# EAGLE schematic adc8_v2 (EAGLE 5.12)

## Sheet 1 of 3
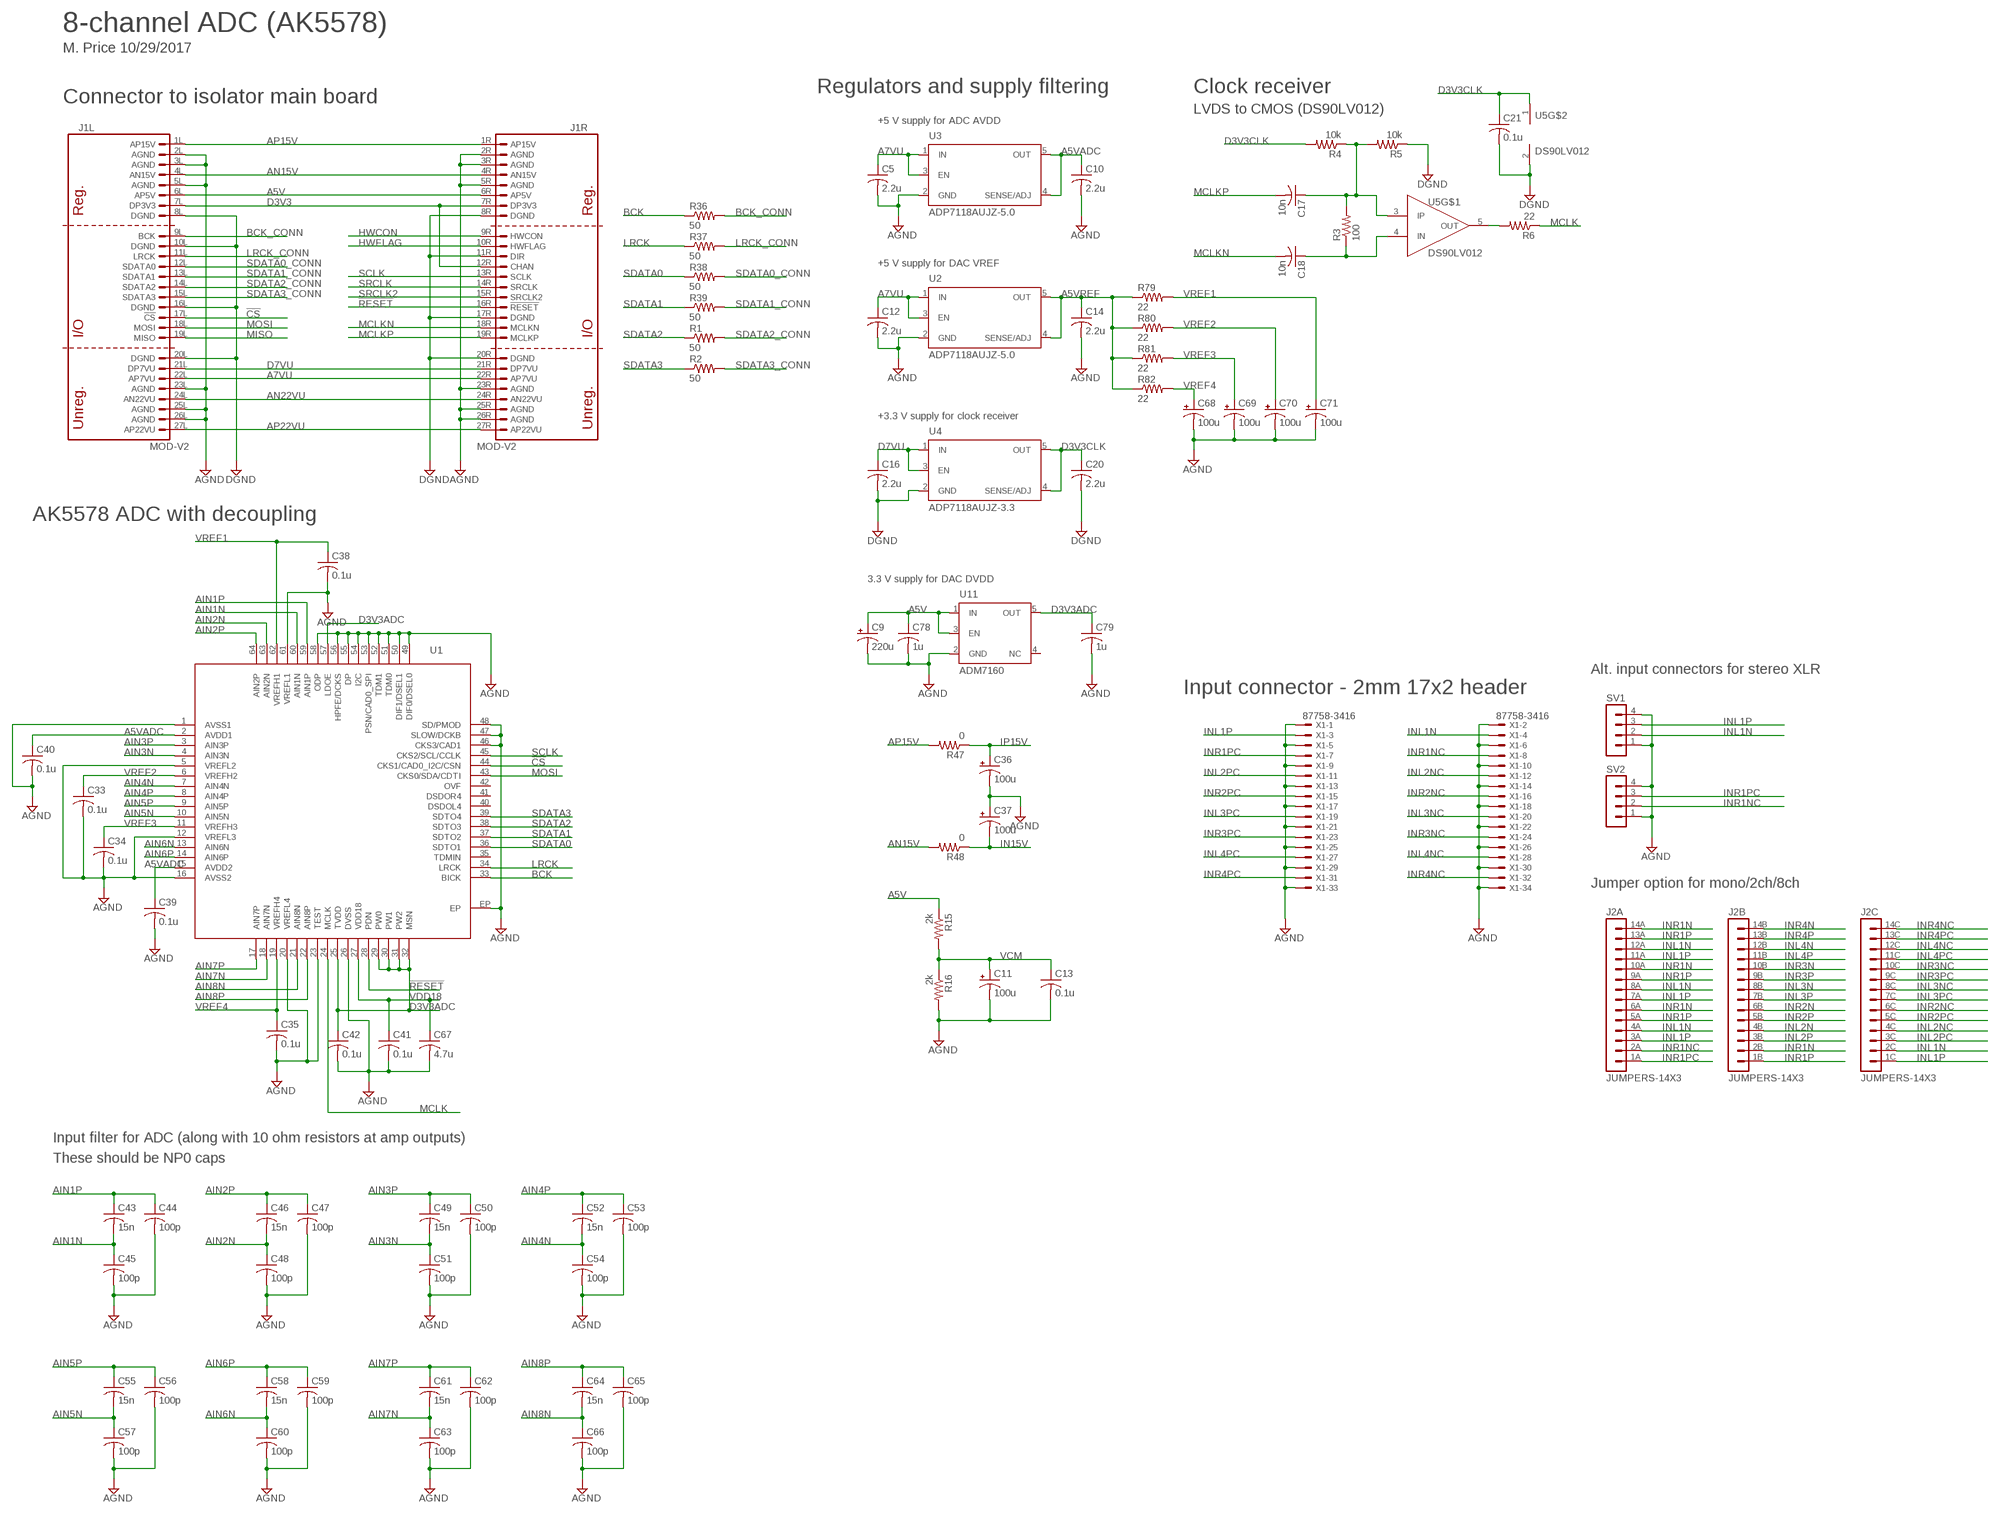
[diagram p0: schematic, sheet 1]

### Parts
C5  2.2u  C-USC0805  [C0805]
C9  220u  CPOL-USE  [PANASONIC_E]
C10  2.2u  C-USC0805  [C0805]
C11  100u  CPOL-USE  [PANASONIC_E]
C12  2.2u  C-USC0805  [C0805]
C13  0.1u  C-USC0603  [C0603]
C14  2.2u  C-USC0805  [C0805]
C16  2.2u  C-USC0805  [C0805]
C17  10n  C-USC0603  [C0603]
C18  10n  C-USC0603  [C0603]
C20  2.2u  C-USC0805  [C0805]
C21  0.1u  C-USC0603  [C0603]
C33  0.1u  C-USC0603  [C0603]
C34  0.1u  C-USC0603  [C0603]
C35  0.1u  C-USC0603  [C0603]
C36  100u  CPOL-USE  [PANASONIC_E]
C37  100u  CPOL-USE  [PANASONIC_E]
C38  0.1u  C-USC0603  [C0603]
C39  0.1u  C-USC0603  [C0603]
C40  0.1u  C-USC0603  [C0603]
C41  0.1u  C-USC0603  [C0603]
C42  0.1u  C-USC0603  [C0603]
C43  15n  C-USC0603  [C0603]
C44  100p  C-USC0603  [C0603]
C45  100p  C-USC0603  [C0603]
C46  15n  C-USC0603  [C0603]
C47  100p  C-USC0603  [C0603]
C48  100p  C-USC0603  [C0603]
C49  15n  C-USC0603  [C0603]
C50  100p  C-USC0603  [C0603]
C51  100p  C-USC0603  [C0603]
C52  15n  C-USC0603  [C0603]
C53  100p  C-USC0603  [C0603]
C54  100p  C-USC0603  [C0603]
C55  15n  C-USC0603  [C0603]
C56  100p  C-USC0603  [C0603]
C57  100p  C-USC0603  [C0603]
C58  15n  C-USC0603  [C0603]
C59  100p  C-USC0603  [C0603]
C60  100p  C-USC0603  [C0603]
C61  15n  C-USC0603  [C0603]
C62  100p  C-USC0603  [C0603]
C63  100p  C-USC0603  [C0603]
C64  15n  C-USC0603  [C0603]
C65  100p  C-USC0603  [C0603]
C66  100p  C-USC0603  [C0603]
C67  4.7u  C-USC1206  [C1206]
C68  100u  CPOL-USD  [PANASONIC_D]
C69  100u  CPOL-USD  [PANASONIC_D]
C70  100u  CPOL-USD  [PANASONIC_D]
C71  100u  CPOL-USD  [PANASONIC_D]
C78  1u  C-USC0603  [C0603]
C79  1u  C-USC0603  [C0603]
J1  MOD-V2  [MOD-V2]
J2  JUMPERS-14X3  [MA14-3]
R1  50  R-US_R0603  [R0603]
R2  50  R-US_R0603  [R0603]
R3  100  R-US_R0603  [R0603]
R4  10k  R-US_R0603  [R0603]
R5  10k  R-US_R0603  [R0603]
R6  22  R-US_R0603  [R0603]
R15  2k  R-US_R0603  [R0603]
R16  2k  R-US_R0603  [R0603]
R36  50  R-US_R0603  [R0603]
R37  50  R-US_R0603  [R0603]
R38  50  R-US_R0603  [R0603]
R39  50  R-US_R0603  [R0603]
R47  0  R-US_R0603  [R0603]
R48  0  R-US_R0603  [R0603]
R79  22  R-US_R0603  [R0603]
R80  22  R-US_R0603  [R0603]
R81  22  R-US_R0603  [R0603]
R82  22  R-US_R0603  [R0603]
SV1  MA04-1  [MA04-1]
SV2  MA04-1  [MA04-1]
U1  AK5558  [QFN64_EP_AKM]
U2  ADP7118AUJZ-5.0  ADP7118AUJZ  [SOT23-DBV]
U3  ADP7118AUJZ-5.0  ADP7118AUJZ  [SOT23-DBV]
U4  ADP7118AUJZ-3.3  ADP7118AUJZ  [SOT23-DBV]
U5  DS90LV012  [SOT23-DBV]
U11  ADM7160  [SOT23-DBV]
X1  87758-3416  [87758-3416]

### Nets
!CS: J1.17L(L:!CS) U1.44(CKS1/CAD0_I2C/CSN)
!RESET: J1.16R(R:!RESET) U1.28(PDN)
A5V: C9.+ C78.1 J1.6L(L:AP5V) J1.6R(R:AP5V) R15.1 U11.1(IN) U11.3(EN) ; also sheet 2,3
A5VADC: C10.1 C39.1 C40.1 U1.2(AVDD1) U1.15(AVDD2) U3.4(SENSE/ADJ) U3.5(OUT)
A5VREF: C14.1 R79.1 R80.1 R81.1 R82.1 U2.4(SENSE/ADJ) U2.5(OUT)
A7VU: C5.1 C12.1 J1.22L(L:AP7VU) J1.22R(R:AP7VU) U2.1(IN) U2.3(EN) U3.1(IN) U3.3(EN)
AGND: C5.2 C9.- C10.2 C11.- C12.2 C13.2 C14.2 C33.2 C34.2 C35.2 C36.- C37.+ C38.2 C39.2 C40.2 C41.2 C42.2 C44.2 C45.2 C47.2 C48.2 C50.2 C51.2 C53.2 C54.2 C56.2 C57.2 C59.2 C60.2 C62.2 C63.2 C65.2 C66.2 C67.2 C68.- C69.- C70.- C71.- C78.2 C79.2 J1.2L(L:AGND) J1.2R(R:AGND) J1.3L(L:AGND) J1.3R(R:AGND) J1.5L(L:AGND) J1.5R(R:AGND) J1.23L(L:AGND) J1.23R(R:AGND) J1.25L(L:AGND) J1.25R(R:AGND) J1.26L(L:AGND) J1.26R(R:AGND) R16.2 SV1.1 SV1.4 SV2.1 SV2.4 U1.1(AVSS1) U1.5(VREFL2) U1.12(VREFL3) U1.16(AVSS2) U1.20(VREFL4) U1.23(TEST) U1.26(DVSS) U1.46(CKS3/CAD1) U1.47(SLOW/DCKB) U1.48(SD/PMOD) U1.49(DIF0/DSEL0) U1.50(DIF1/DSEL1) U1.51(TDM0) U1.52(TDM1) U1.53(PSN/CAD0_SPI) U1.54(I2C) U1.55(DP) U1.56(HPFE/DCKS) U1.58(ODP) U1.61(VREFL1) U1.EP U2.2(GND) U3.2(GND) U11.2(GND) X1.1 X1.2 X1.5 X1.6 X1.9 X1.10 X1.13 X1.14 X1.17 X1.18 X1.21 X1.22 X1.25 X1.26 X1.29 X1.30 X1.33 X1.34 ; also sheet 2,3
AIN1N: C43.2 C45.1 U1.60(AIN1N) ; also sheet 2
AIN1P: C43.1 C44.1 U1.59(AIN1P) ; also sheet 2
AIN2N: C46.2 C48.1 U1.63(AIN2N) ; also sheet 2
AIN2P: C46.1 C47.1 U1.64(AIN2P) ; also sheet 2
AIN3N: C49.2 C51.1 U1.4(AIN3N) ; also sheet 2
AIN3P: C49.1 C50.1 U1.3(AIN3P) ; also sheet 2
AIN4N: C52.2 C54.1 U1.7(AIN4N) ; also sheet 2
AIN4P: C52.1 C53.1 U1.8(AIN4P) ; also sheet 2
AIN5N: C55.2 C57.1 U1.10(AIN5N) ; also sheet 3
AIN5P: C55.1 C56.1 U1.9(AIN5P) ; also sheet 3
AIN6N: C58.2 C60.1 U1.13(AIN6N) ; also sheet 3
AIN6P: C58.1 C59.1 U1.14(AIN6P) ; also sheet 3
AIN7N: C61.2 C63.1 U1.18(AIN7N) ; also sheet 3
AIN7P: C61.1 C62.1 U1.17(AIN7P) ; also sheet 3
AIN8N: C64.2 C66.1 U1.21(AIN8N) ; also sheet 3
AIN8P: C64.1 C65.1 U1.22(AIN8P) ; also sheet 3
AN15V: J1.4L(L:AN15V) J1.4R(R:AN15V) R48.2
AN22VU: J1.24L(L:AN22VU) J1.24R(R:AN22VU)
AP15V: J1.1L(L:AP15V) J1.1R(R:AP15V) R47.2
AP22VU: J1.27L(L:AP22VU) J1.27R(R:AP22VU)
BCK: R36.1 U1.33(BICK)
BCK_CONN: J1.9L(L:BCK) R36.2
D3V3: J1.7L(L:DP3V3) J1.7R(R:DP3V3) J1.12R(R:CHAN)
D3V3ADC: C42.1 C79.1 U1.25(TVDD) U1.29(PW0) U1.30(PW1) U1.31(PW2) U1.32(MSN) U1.57(LDOE) U11.5(OUT)
D3V3CLK: C20.1 C21.1 R4.2 U4.4(SENSE/ADJ) U4.5(OUT) U5.1(V+)
D7VU: C16.1 J1.21L(L:DP7VU) J1.21R(R:DP7VU) U4.1(IN) U4.3(EN)
DGND: C16.2 C20.2 C21.2 J1.8L(L:DGND) J1.8R(R:DGND) J1.10L(L:DGND) J1.11R(R:DIR) J1.16L(L:DGND) J1.17R(R:DGND) J1.20L(L:DGND) J1.20R(R:DGND) R5.1 U4.2(GND) U5.2(V-)
HWCON: J1.9R(R:HWCON)
HWFLAG: J1.10R(R:HWFLAG)
IN15V: C37.- R48.1 ; also sheet 2,3
INL1N: J2.2C J2.4A J2.8A J2.12A SV1.2 X1.4 ; also sheet 2
INL1P: J2.1C J2.3A J2.7A J2.11A SV1.3 X1.3 ; also sheet 2
INL2N: J2.4B ; also sheet 2
INL2NC: J2.4C X1.12
INL2P: J2.3B ; also sheet 2
INL2PC: J2.3C X1.11
INL3N: J2.8B ; also sheet 3
INL3NC: J2.8C X1.20
INL3P: J2.7B ; also sheet 3
INL3PC: J2.7C X1.19
INL4N: J2.12B ; also sheet 3
INL4NC: J2.12C X1.28
INL4P: J2.11B ; also sheet 3
INL4PC: J2.11C X1.27
INR1N: J2.2B J2.6A J2.10A J2.14A ; also sheet 2
INR1NC: J2.2A SV2.2 X1.8
INR1P: J2.1B J2.5A J2.9A J2.13A ; also sheet 2
INR1PC: J2.1A SV2.3 X1.7
INR2N: J2.6B ; also sheet 2
INR2NC: J2.6C X1.16
INR2P: J2.5B ; also sheet 2
INR2PC: J2.5C X1.15
INR3N: J2.10B ; also sheet 3
INR3NC: J2.10C X1.24
INR3P: J2.9B ; also sheet 3
INR3PC: J2.9C X1.23
INR4N: J2.14B ; also sheet 3
INR4NC: J2.14C X1.32
INR4P: J2.13B ; also sheet 3
INR4PC: J2.13C X1.31
IP15V: C36.+ R47.1 ; also sheet 2,3
LRCK: R37.1 U1.34(LRCK)
LRCK_CONN: J1.11L(L:LRCK) R37.2
MCLK: R6.1 U1.24(MCLK)
MCLKN: C18.2 J1.18R(R:MCLKN)
MCLKP: C17.2 J1.19R(R:MCLKP)
MISO: J1.19L(L:MISO)
MOSI: J1.18L(L:MOSI) U1.43(CKS0/SDA/CDTI)
N$16: C17.1 R3.2 R4.1 R5.2 U5.3(IP)
N$20: C18.1 R3.1 U5.4(IN)
N$24: R6.2 U5.5(OUT)
SCLK: J1.13R(R:SCLK) U1.45(CKS2/SCL/CCLK)
SDATA0: R38.1 U1.36(SDTO1)
SDATA0_CONN: J1.12L(L:SDATA0) R38.2
SDATA1: R39.1 U1.37(SDTO2)
SDATA1_CONN: J1.13L(L:SDATA1) R39.2
SDATA2: R1.1 U1.38(SDTO3)
SDATA2_CONN: J1.14L(L:SDATA2) R1.2
SDATA3: R2.1 U1.39(SDTO4)
SDATA3_CONN: J1.15L(L:SDATA3) R2.2
SRCLK: J1.14R(R:SRCLK)
SRCLK2: J1.15R(R:SRCLK2)
VCM: C11.+ C13.1 R15.2 R16.1 ; also sheet 2,3
VDD18: C41.1 C67.1 U1.27(VDD18)
VREF1: C38.1 C71.+ R79.2 U1.62(VREFH1)
VREF2: C33.1 C70.+ R80.2 U1.6(VREFH2)
VREF3: C34.1 C69.+ R81.2 U1.11(VREFH3)
VREF4: C35.1 C68.+ R82.2 U1.19(VREFH4)
Unconnected: U1.35(TDMIN) U1.40(DSDOL4) U1.41(DSDOR4) U1.42(OVF) U11.4(NC)

### Notes on the sheet
- 8-channel ADC (AK5578)
- M. Price 10/29/2017
- Regulators and supply filtering | Clock receiver
- Connector to isolator main board
- LVDS to CMOS (DS90LV012)
- +5 V supply for ADC AVDD
- +5 V supply for DAC VREF
- +3.3 V supply for clock receiver
- AK5578 ADC with decoupling
- 3.3 V supply for DAC DVDD
- Alt. input connectors for stereo XLR
- Input connector - 2mm 17x2 header
- Jumper option for mono/2ch/8ch
- Input filter for ADC (along with 10 ohm resistors at amp outputs)
- These should be NP0 caps

## Sheet 2 of 3
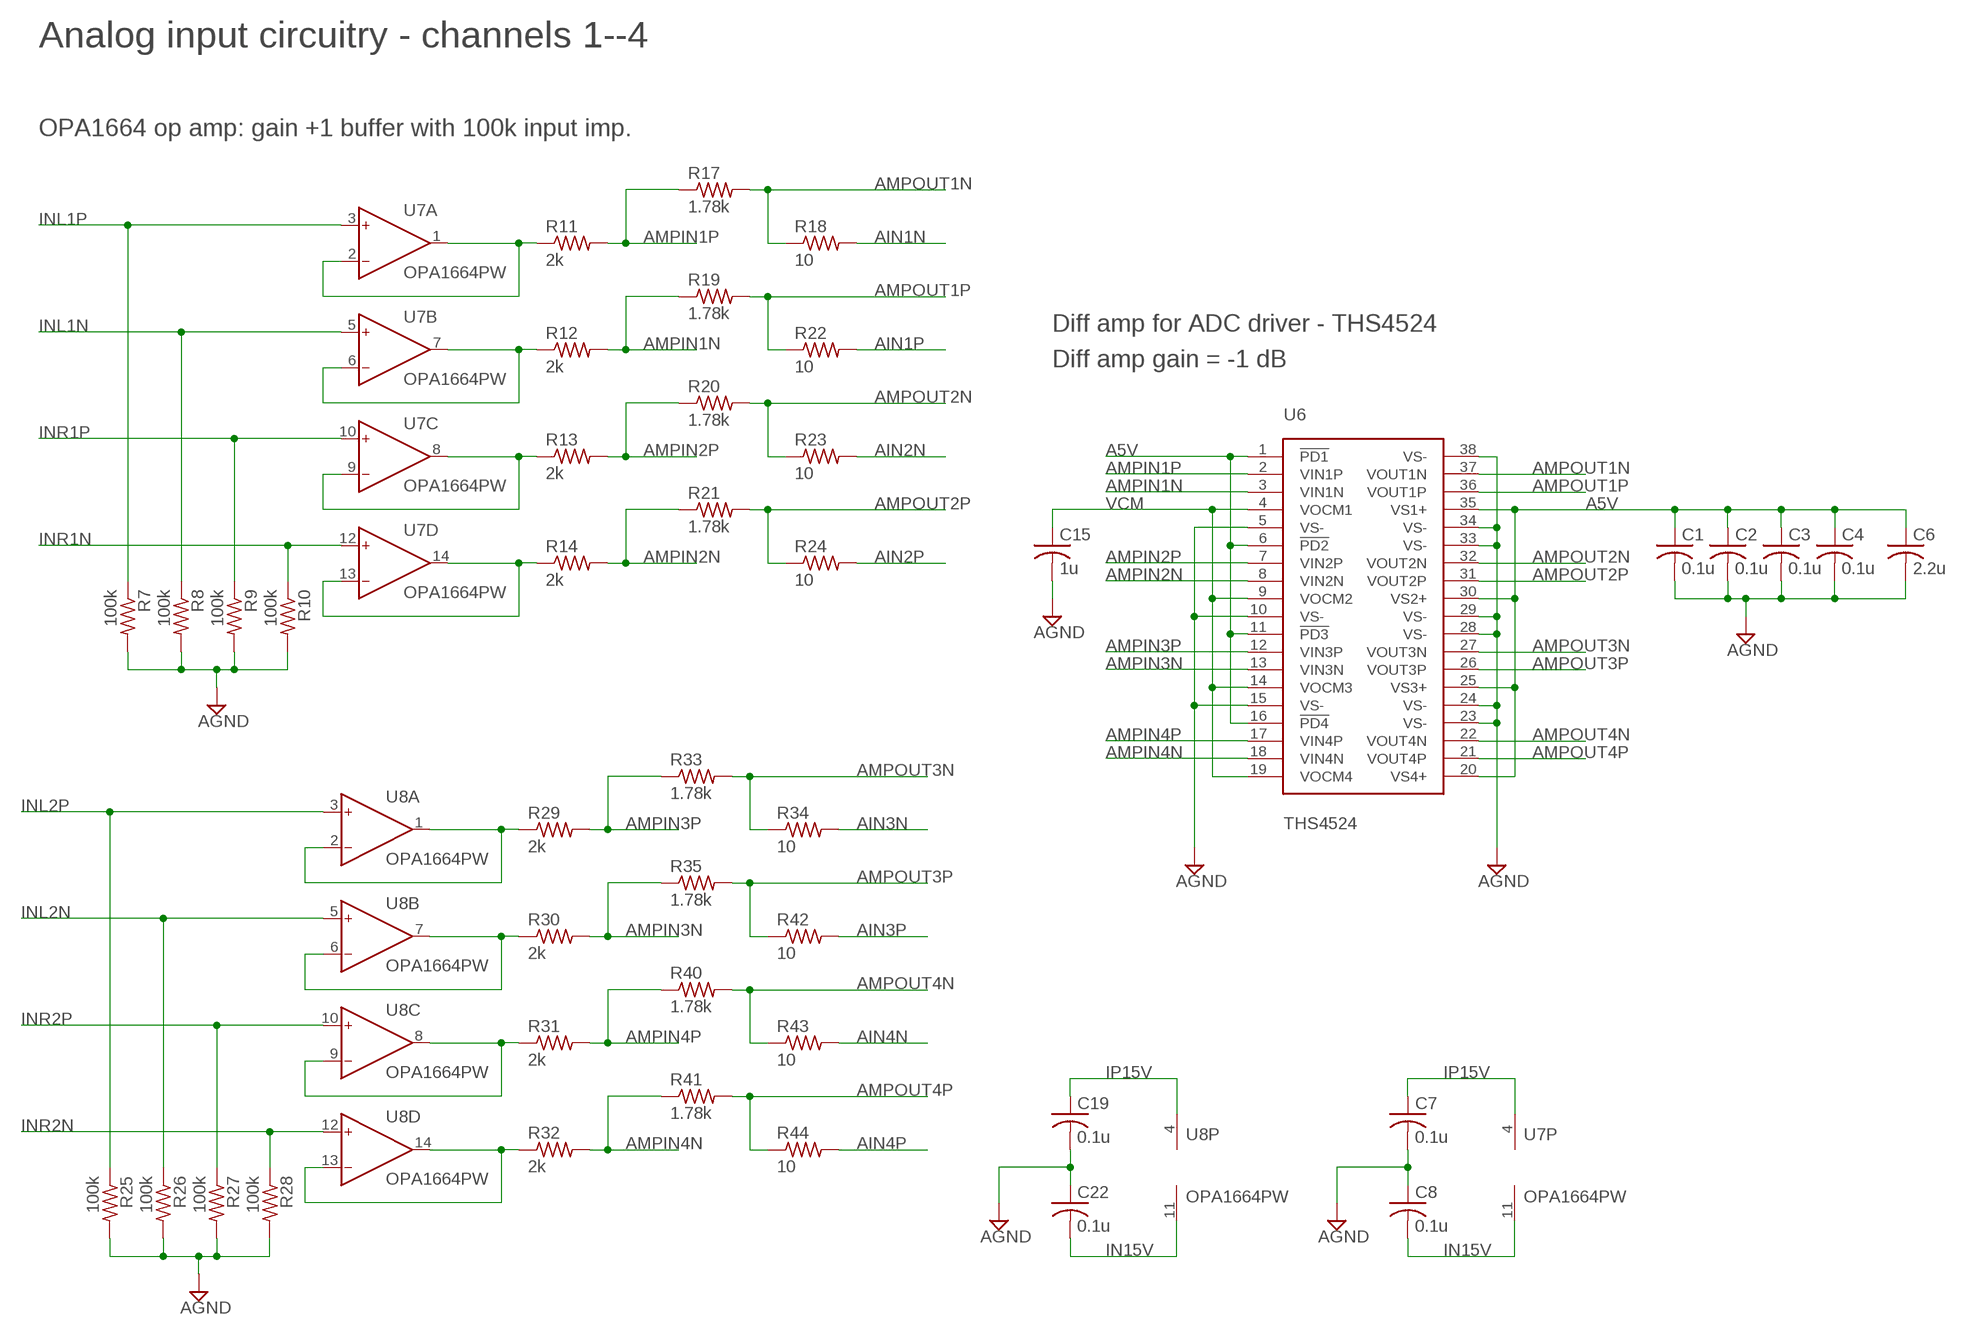
[diagram p1: schematic, sheet 2]

### Parts
C1  0.1u  C-USC0603  [C0603]
C2  0.1u  C-USC0603  [C0603]
C3  0.1u  C-USC0603  [C0603]
C4  0.1u  C-USC0603  [C0603]
C6  2.2u  C-USC0805  [C0805]
C7  0.1u  C-USC0603  [C0603]
C8  0.1u  C-USC0603  [C0603]
C15  1u  C-USC0603  [C0603]
C19  0.1u  C-USC0603  [C0603]
C22  0.1u  C-USC0603  [C0603]
R7  100k  R-US_R0603  [R0603]
R8  100k  R-US_R0603  [R0603]
R9  100k  R-US_R0603  [R0603]
R10  100k  R-US_R0603  [R0603]
R11  2k  R-US_R0603  [R0603]
R12  2k  R-US_R0603  [R0603]
R13  2k  R-US_R0603  [R0603]
R14  2k  R-US_R0603  [R0603]
R17  1.78k  R-US_R0603  [R0603]
R18  10  R-US_R0603  [R0603]
R19  1.78k  R-US_R0603  [R0603]
R20  1.78k  R-US_R0603  [R0603]
R21  1.78k  R-US_R0603  [R0603]
R22  10  R-US_R0603  [R0603]
R23  10  R-US_R0603  [R0603]
R24  10  R-US_R0603  [R0603]
R25  100k  R-US_R0603  [R0603]
R26  100k  R-US_R0603  [R0603]
R27  100k  R-US_R0603  [R0603]
R28  100k  R-US_R0603  [R0603]
R29  2k  R-US_R0603  [R0603]
R30  2k  R-US_R0603  [R0603]
R31  2k  R-US_R0603  [R0603]
R32  2k  R-US_R0603  [R0603]
R33  1.78k  R-US_R0603  [R0603]
R34  10  R-US_R0603  [R0603]
R35  1.78k  R-US_R0603  [R0603]
R40  1.78k  R-US_R0603  [R0603]
R41  1.78k  R-US_R0603  [R0603]
R42  10  R-US_R0603  [R0603]
R43  10  R-US_R0603  [R0603]
R44  10  R-US_R0603  [R0603]
U6  THS4524  [TSSOP38_R-PDSO-G38-DA]
U7  OPA1664PW  AD8544RU  [TSSOP14]
U8  OPA1664PW  AD8544RU  [TSSOP14]

### Nets
A5V: C1.1 C2.1 C3.1 C4.1 C6.1 U6.1(!PD1) U6.6(!PD2) U6.11(!PD3) U6.16(!PD4) U6.20(VS4+) U6.25(VS3+) U6.30(VS2+) U6.35(VS1+) ; also sheet 1,3
AGND: C1.2 C2.2 C3.2 C4.2 C6.2 C7.2 C8.1 C15.2 C19.2 C22.1 R7.2 R8.2 R9.2 R10.2 R25.2 R26.2 R27.2 R28.2 U6.5(VS-) U6.10(VS-) U6.15(VS-) U6.23(VS-) U6.24(VS-) U6.28(VS-) U6.29(VS-) U6.33(VS-) U6.34(VS-) U6.38(VS-) ; also sheet 1,3
AIN1N: R18.2 ; also sheet 1
AIN1P: R22.2 ; also sheet 1
AIN2N: R23.2 ; also sheet 1
AIN2P: R24.2 ; also sheet 1
AIN3N: R34.2 ; also sheet 1
AIN3P: R42.2 ; also sheet 1
AIN4N: R43.2 ; also sheet 1
AIN4P: R44.2 ; also sheet 1
AMPIN1N: R12.2 R19.1 U6.3(VIN1N)
AMPIN1P: R11.2 R17.1 U6.2(VIN1P)
AMPIN2N: R14.2 R21.1 U6.8(VIN2N)
AMPIN2P: R13.2 R20.1 U6.7(VIN2P)
AMPIN3N: R30.2 R35.1 U6.13(VIN3N)
AMPIN3P: R29.2 R33.1 U6.12(VIN3P)
AMPIN4N: R32.2 R41.1 U6.18(VIN4N)
AMPIN4P: R31.2 R40.1 U6.17(VIN4P)
AMPOUT1N: R17.2 R18.1 U6.37(VOUT1N)
AMPOUT1P: R19.2 R22.1 U6.36(VOUT1P)
AMPOUT2N: R20.2 R23.1 U6.32(VOUT2N)
AMPOUT2P: R21.2 R24.1 U6.31(VOUT2P)
AMPOUT3N: R33.2 R34.1 U6.27(VOUT3N)
AMPOUT3P: R35.2 R42.1 U6.26(VOUT3P)
AMPOUT4N: R40.2 R43.1 U6.22(VOUT4N)
AMPOUT4P: R41.2 R44.1 U6.21(VOUT4P)
IN15V: C8.2 C22.2 U7.11(P:V-) U8.11(P:V-) ; also sheet 1,3
INL1N: R8.1 U7.5(B:IN+) ; also sheet 1
INL1P: R7.1 U7.3(A:IN+) ; also sheet 1
INL2N: R26.1 U8.5(B:IN+) ; also sheet 1
INL2P: R25.1 U8.3(A:IN+) ; also sheet 1
INR1N: R10.1 U7.12(D:IN+) ; also sheet 1
INR1P: R9.1 U7.10(C:IN+) ; also sheet 1
INR2N: R28.1 U8.12(D:IN+) ; also sheet 1
INR2P: R27.1 U8.10(C:IN+) ; also sheet 1
IP15V: C7.1 C19.1 U7.4(P:V+) U8.4(P:V+) ; also sheet 1,3
N$1: R11.1 U7.1(A:OUT) U7.2(A:IN-)
N$2: R12.1 U7.6(B:IN-) U7.7(B:OUT)
N$3: R13.1 U7.8(C:OUT) U7.9(C:IN-)
N$4: R14.1 U7.13(D:IN-) U7.14(D:OUT)
N$5: R29.1 U8.1(A:OUT) U8.2(A:IN-)
N$6: R30.1 U8.6(B:IN-) U8.7(B:OUT)
N$7: R31.1 U8.8(C:OUT) U8.9(C:IN-)
N$8: R32.1 U8.13(D:IN-) U8.14(D:OUT)
VCM: C15.1 U6.4(VOCM1) U6.9(VOCM2) U6.14(VOCM3) U6.19(VOCM4) ; also sheet 1,3

### Notes on the sheet
- Analog input circuitry - channels 1--4
- OPA1664 op amp: gain +1 buffer with 100k input imp.
- Diff amp for ADC driver - THS4524
- Diff amp gain = -1 dB

## Sheet 3 of 3
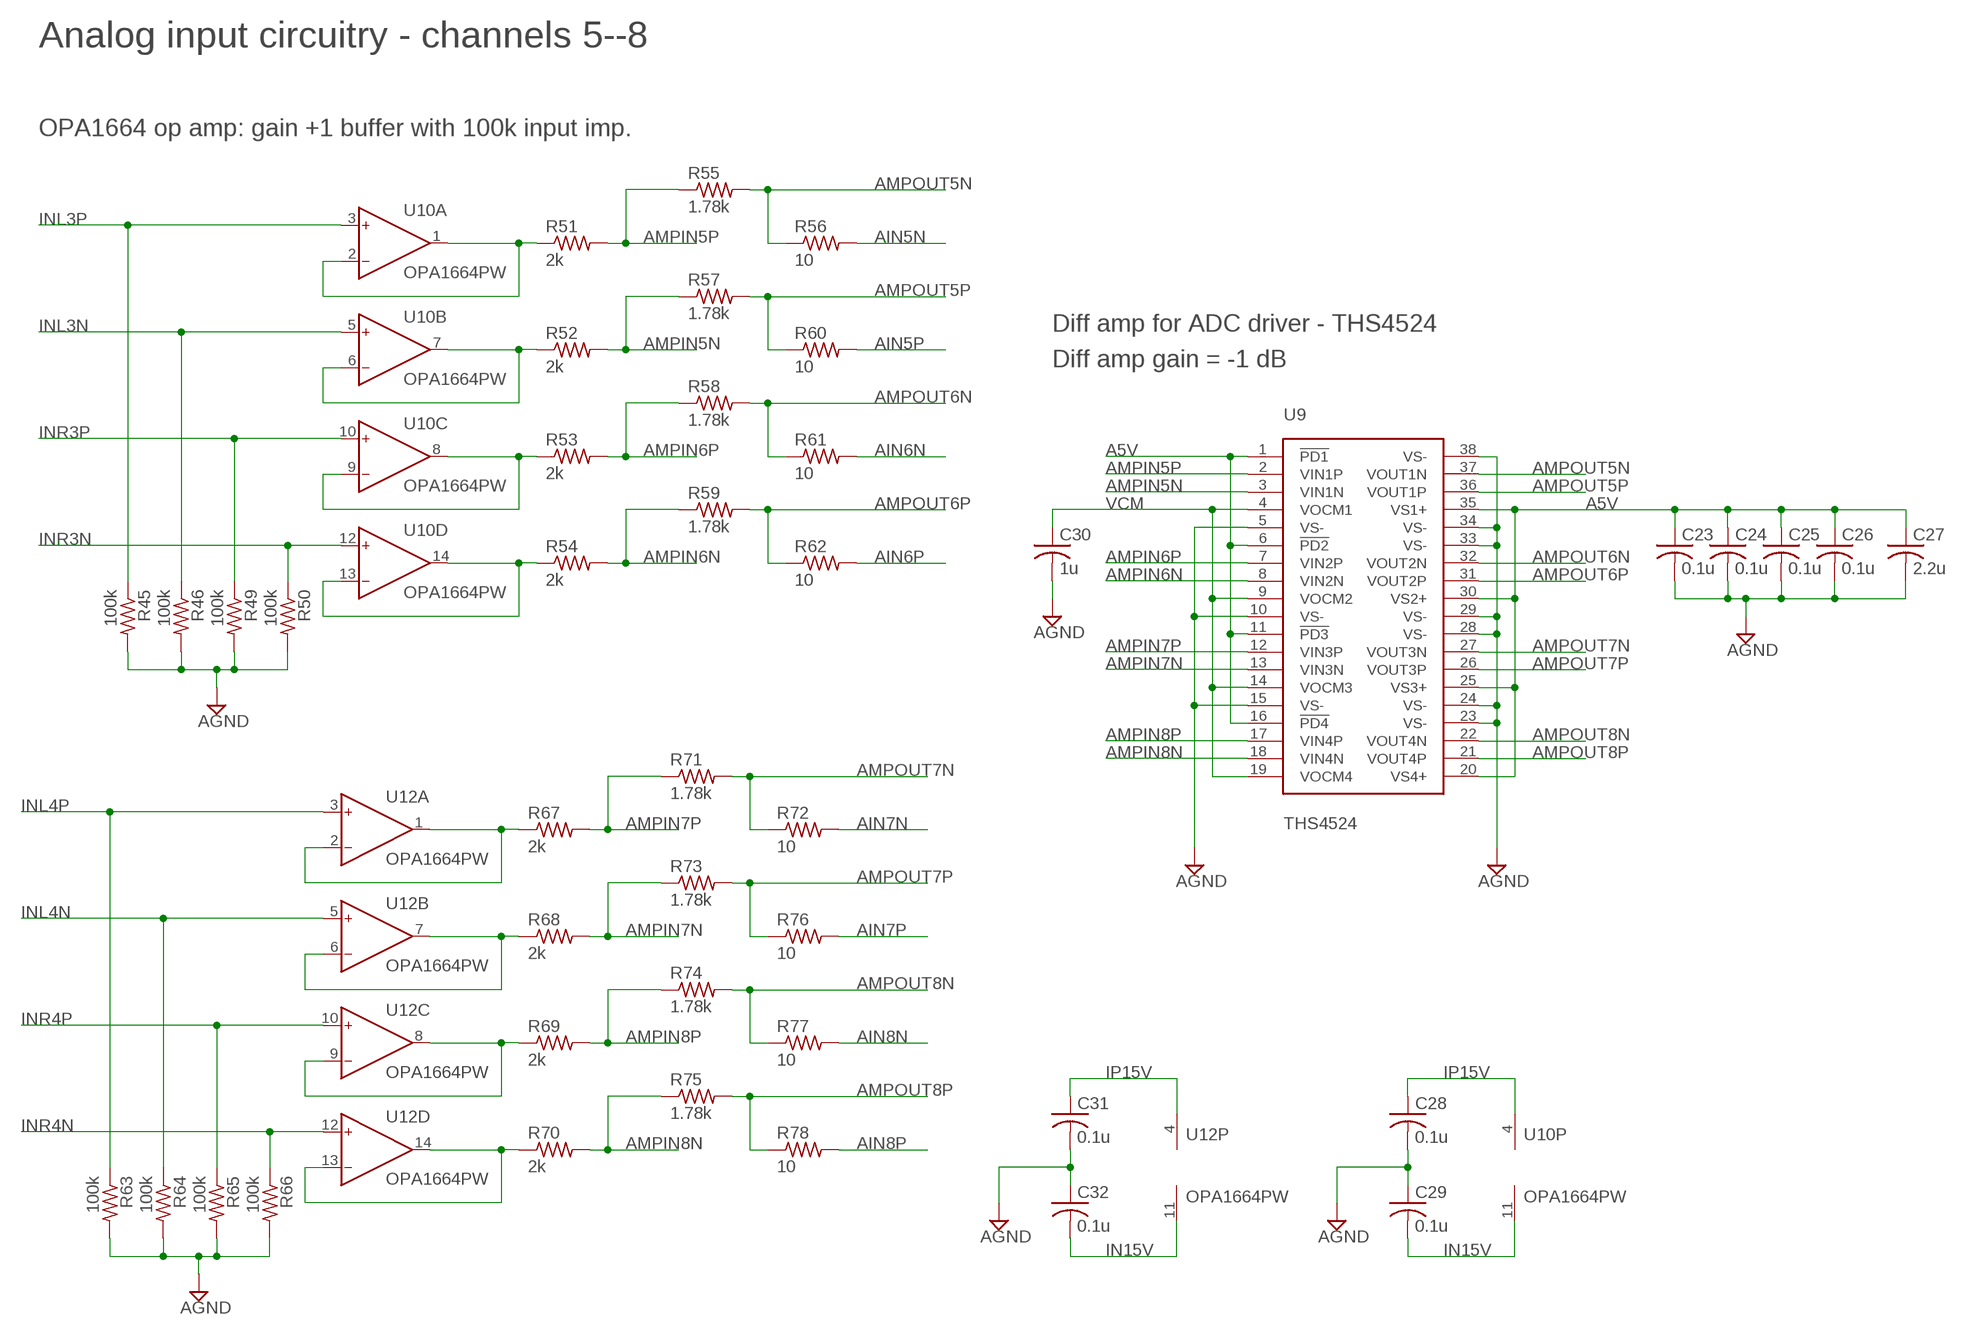
[diagram p2: schematic, sheet 3]

### Parts
C23  0.1u  C-USC0603  [C0603]
C24  0.1u  C-USC0603  [C0603]
C25  0.1u  C-USC0603  [C0603]
C26  0.1u  C-USC0603  [C0603]
C27  2.2u  C-USC0805  [C0805]
C28  0.1u  C-USC0603  [C0603]
C29  0.1u  C-USC0603  [C0603]
C30  1u  C-USC0603  [C0603]
C31  0.1u  C-USC0603  [C0603]
C32  0.1u  C-USC0603  [C0603]
R45  100k  R-US_R0603  [R0603]
R46  100k  R-US_R0603  [R0603]
R49  100k  R-US_R0603  [R0603]
R50  100k  R-US_R0603  [R0603]
R51  2k  R-US_R0603  [R0603]
R52  2k  R-US_R0603  [R0603]
R53  2k  R-US_R0603  [R0603]
R54  2k  R-US_R0603  [R0603]
R55  1.78k  R-US_R0603  [R0603]
R56  10  R-US_R0603  [R0603]
R57  1.78k  R-US_R0603  [R0603]
R58  1.78k  R-US_R0603  [R0603]
R59  1.78k  R-US_R0603  [R0603]
R60  10  R-US_R0603  [R0603]
R61  10  R-US_R0603  [R0603]
R62  10  R-US_R0603  [R0603]
R63  100k  R-US_R0603  [R0603]
R64  100k  R-US_R0603  [R0603]
R65  100k  R-US_R0603  [R0603]
R66  100k  R-US_R0603  [R0603]
R67  2k  R-US_R0603  [R0603]
R68  2k  R-US_R0603  [R0603]
R69  2k  R-US_R0603  [R0603]
R70  2k  R-US_R0603  [R0603]
R71  1.78k  R-US_R0603  [R0603]
R72  10  R-US_R0603  [R0603]
R73  1.78k  R-US_R0603  [R0603]
R74  1.78k  R-US_R0603  [R0603]
R75  1.78k  R-US_R0603  [R0603]
R76  10  R-US_R0603  [R0603]
R77  10  R-US_R0603  [R0603]
R78  10  R-US_R0603  [R0603]
U9  THS4524  [TSSOP38_R-PDSO-G38-DA]
U10  OPA1664PW  AD8544RU  [TSSOP14]
U12  OPA1664PW  AD8544RU  [TSSOP14]

### Nets
A5V: C23.1 C24.1 C25.1 C26.1 C27.1 U9.1(!PD1) U9.6(!PD2) U9.11(!PD3) U9.16(!PD4) U9.20(VS4+) U9.25(VS3+) U9.30(VS2+) U9.35(VS1+) ; also sheet 1,2
AGND: C23.2 C24.2 C25.2 C26.2 C27.2 C28.2 C29.1 C30.2 C31.2 C32.1 R45.2 R46.2 R49.2 R50.2 R63.2 R64.2 R65.2 R66.2 U9.5(VS-) U9.10(VS-) U9.15(VS-) U9.23(VS-) U9.24(VS-) U9.28(VS-) U9.29(VS-) U9.33(VS-) U9.34(VS-) U9.38(VS-) ; also sheet 1,2
AIN5N: R56.2 ; also sheet 1
AIN5P: R60.2 ; also sheet 1
AIN6N: R61.2 ; also sheet 1
AIN6P: R62.2 ; also sheet 1
AIN7N: R72.2 ; also sheet 1
AIN7P: R76.2 ; also sheet 1
AIN8N: R77.2 ; also sheet 1
AIN8P: R78.2 ; also sheet 1
AMPIN5N: R52.2 R57.1 U9.3(VIN1N)
AMPIN5P: R51.2 R55.1 U9.2(VIN1P)
AMPIN6N: R54.2 R59.1 U9.8(VIN2N)
AMPIN6P: R53.2 R58.1 U9.7(VIN2P)
AMPIN7N: R68.2 R73.1 U9.13(VIN3N)
AMPIN7P: R67.2 R71.1 U9.12(VIN3P)
AMPIN8N: R70.2 R75.1 U9.18(VIN4N)
AMPIN8P: R69.2 R74.1 U9.17(VIN4P)
AMPOUT5N: R55.2 R56.1 U9.37(VOUT1N)
AMPOUT5P: R57.2 R60.1 U9.36(VOUT1P)
AMPOUT6N: R58.2 R61.1 U9.32(VOUT2N)
AMPOUT6P: R59.2 R62.1 U9.31(VOUT2P)
AMPOUT7N: R71.2 R72.1 U9.27(VOUT3N)
AMPOUT7P: R73.2 R76.1 U9.26(VOUT3P)
AMPOUT8N: R74.2 R77.1 U9.22(VOUT4N)
AMPOUT8P: R75.2 R78.1 U9.21(VOUT4P)
IN15V: C29.2 C32.2 U10.11(P:V-) U12.11(P:V-) ; also sheet 1,2
INL3N: R46.1 U10.5(B:IN+) ; also sheet 1
INL3P: R45.1 U10.3(A:IN+) ; also sheet 1
INL4N: R64.1 U12.5(B:IN+) ; also sheet 1
INL4P: R63.1 U12.3(A:IN+) ; also sheet 1
INR3N: R50.1 U10.12(D:IN+) ; also sheet 1
INR3P: R49.1 U10.10(C:IN+) ; also sheet 1
INR4N: R66.1 U12.12(D:IN+) ; also sheet 1
INR4P: R65.1 U12.10(C:IN+) ; also sheet 1
IP15V: C28.1 C31.1 U10.4(P:V+) U12.4(P:V+) ; also sheet 1,2
N$9: R51.1 U10.1(A:OUT) U10.2(A:IN-)
N$10: R52.1 U10.6(B:IN-) U10.7(B:OUT)
N$11: R53.1 U10.8(C:OUT) U10.9(C:IN-)
N$12: R54.1 U10.13(D:IN-) U10.14(D:OUT)
N$13: R67.1 U12.1(A:OUT) U12.2(A:IN-)
N$14: R68.1 U12.6(B:IN-) U12.7(B:OUT)
N$15: R69.1 U12.8(C:OUT) U12.9(C:IN-)
N$17: R70.1 U12.13(D:IN-) U12.14(D:OUT)
VCM: C30.1 U9.4(VOCM1) U9.9(VOCM2) U9.14(VOCM3) U9.19(VOCM4) ; also sheet 1,2

### Notes on the sheet
- Analog input circuitry - channels 5--8
- OPA1664 op amp: gain +1 buffer with 100k input imp.
- Diff amp for ADC driver - THS4524
- Diff amp gain = -1 dB

## Library data of the parts
C1-C8 C10 C12-C35 C38-C67 C78 C79 = rcl:C-US: CAPACITOR, American symbol
C9 C11 C36 C37 C68-C71 = rcl:CPOL-US: POLARIZED CAPACITOR, American symbol
J1 = cdp:MOD-V2
J2 = cdp:JUMPERS-14X3
R1-R82 = rcl:R-US_: RESISTOR, American symbol
SV1 SV2 = con-lstb:MA04-1: PIN HEADER; OC_FARNELL: unknown; OC_NEWARK: unknown
U1 = cdp:AK5558
U2-U4 = cdp:ADP7118
U5 = cdp:DS90LV012
U6 U9 = cdp:THS4524
U7 U8 U10 U12 = analog-devices:AD8544: General-Purpose CMOS Rail-to-Rail Amplifiers Source: http://www.analog.com/static/imported-files/data_sheets/AD8541_8542_8544.pdf; MPN: AD8544ARUZ; OC_FARNELL: unknown; OC_NEWARK: 15P1001
U11 = cdp:ADM7160
X1 = con-molex:87758-3416: 34 Pin - 2mm Dual Row Single Wafer, Vertical T/H HDR Source: http://www.molex.com/pdm_docs/sd/877580616_sd.pdf; MPN: 87758-3416; OC_FARNELL: unknown; OC_NEWARK: 25M5686